# EAGLE schematic MCP2515_PDIP[1123] (EAGLE 7.7.0)
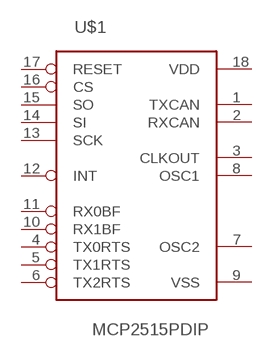
[diagram p0: schematic, sheet 1]

## Parts
U$1  MCP2515PDIP  [DIL18]
Unconnected: U$1.1(TXCAN) U$1.2(RXCAN) U$1.3(CLKOUT) U$1.4(TX0RTS) U$1.5(TX1RTS) U$1.6(TX2RTS) U$1.7(OSC2) U$1.8(OSC1) U$1.10(RX1BF) U$1.11(RX0BF) U$1.12(INT) U$1.13(SCK) U$1.14(SI) U$1.15(SO) U$1.16(CS) U$1.17(RESET)

## Power pins joined to a net without a drawn wire
VDD: U$1.18(VDD)
VSS: U$1.9(VSS)

## Library data of the parts
U$1 = sp2:MCP2515